# EAGLE design LilyPad-E-Sewing-Kit_v14 (EAGLE 7.7.0)
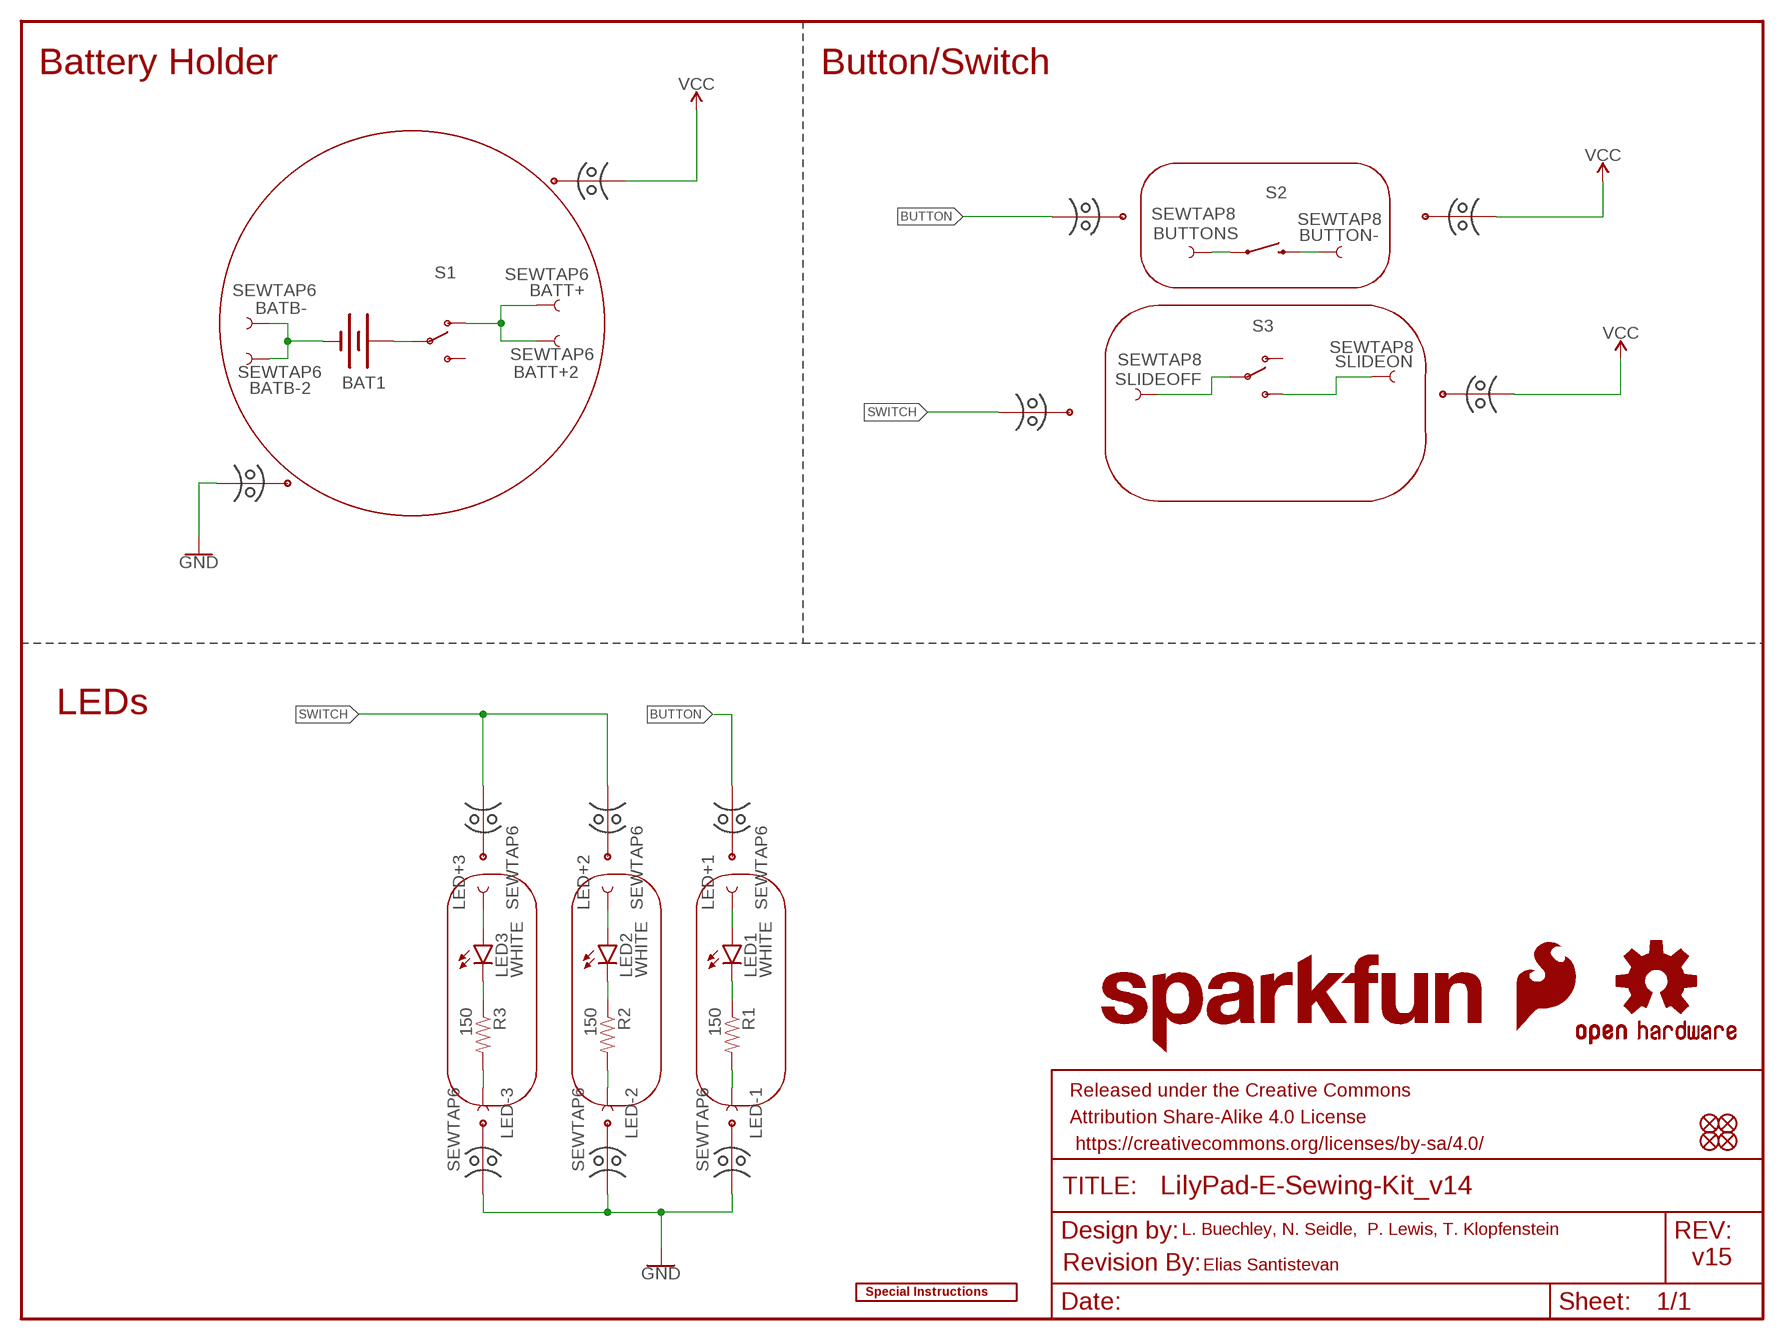
[diagram p0: schematic, sheet 1]

## Parts
BAT1  20mm coincell  BATTERY20MM_4LEGS  [BATTCON_20MM_4LEGS]
BATB-  SEWTAP6  [PETAL-SMALL-2SIDE]
BATB-2  SEWTAP6  [PETAL-SMALL-2SIDE]
BATT+  SEWTAP6  [PETAL-SMALL-2SIDE]
BATT+2  SEWTAP6  [PETAL-SMALL-2SIDE]
BUTTON-  SEWTAP8  [PETAL-MEDIUM-2SIDE]
BUTTONS  SEWTAP8  [PETAL-MEDIUM-2SIDE]
FD1  FIDUCIALUFIDUCIAL  [MICRO-FIDUCIAL]
FD2  FIDUCIALUFIDUCIAL  [MICRO-FIDUCIAL]
FD3  FIDUCIALUFIDUCIAL  [MICRO-FIDUCIAL]
FD4  FIDUCIALUFIDUCIAL  [MICRO-FIDUCIAL]
FRAME1  FRAME-LETTER  [CREATIVE_COMMONS]
LED1  WHITE  LED-WHITE1206  [LED-1206]
LED2  WHITE  LED-WHITE1206  [LED-1206]
LED3  WHITE  LED-WHITE1206  [LED-1206]
LED+1  SEWTAP6  [PETAL-SMALL-2SIDE]
LED+2  SEWTAP6  [PETAL-SMALL-2SIDE]
LED+3  SEWTAP6  [PETAL-SMALL-2SIDE]
LED-1  SEWTAP6  [PETAL-SMALL-2SIDE]
LED-2  SEWTAP6  [PETAL-SMALL-2SIDE]
LED-3  SEWTAP6  [PETAL-SMALL-2SIDE]
LOGO1  SFE_LOGO_FLAME.1_INCH  [SFE_LOGO_FLAME_.1]
LOGO2  OSHW-LOGOS  [OSHW-LOGO-S]
LOGO3  SFE_LOGO_NAME.1_INCH  [SFE_LOGO_NAME_.1]
MB1  MOUSE-BITE-12_HOLES  [MOUST-BITE-1-(2_HOLES)]
MB2  MOUSE-BITE-12_HOLES  [MOUST-BITE-1-(2_HOLES)]
MB3  MOUSE-BITE-12_HOLES  [MOUST-BITE-1-(2_HOLES)]
MB4  MOUSE-BITE-12_HOLES  [MOUST-BITE-1-(2_HOLES)]
MB5  MOUSE-BITE-12_HOLES  [MOUST-BITE-1-(2_HOLES)]
MB6  MOUSE-BITE-12_HOLES  [MOUST-BITE-1-(2_HOLES)]
MB7  MOUSE-BITE-12_HOLES  [MOUST-BITE-1-(2_HOLES)]
MB8  MOUSE-BITE-12_HOLES  [MOUST-BITE-1-(2_HOLES)]
MB9  MOUSE-BITE-12_HOLES  [MOUST-BITE-1-(2_HOLES)]
MB10  MOUSE-BITE-12_HOLES  [MOUST-BITE-1-(2_HOLES)]
MB+  MOUSE-BITE-12_HOLES  [MOUST-BITE-1-(2_HOLES)]
MB-  MOUSE-BITE-12_HOLES  [MOUST-BITE-1-(2_HOLES)]
R1  150  150OHM-1/10W-1%(0603)  [0603-RES]
R2  150  150OHM-1/10W-1%(0603)  [0603-RES]
R3  150  150OHM-1/10W-1%(0603)  [0603-RES]
S1  S1  SWITCH-SPDTSMD  [AYZ0202]
S2  SWITCH-MOMENTARY-2SMD  [TACTILE-SWITCH-SMD]
S3  S3  SWITCH-SPDTSMD  [AYZ0202]
SLIDEOFF  SEWTAP8  [PETAL-MEDIUM-2SIDE]
SLIDEON  SEWTAP8  [PETAL-MEDIUM-2SIDE]
U$1  REVISION  [REVISION]
U$9  SPECIAL_INSTRUCTIONS-ORDERING  [ORDERING_INSTRUCTIONS]

## Nets
BUTTON: BUTTONS.1 LED1.A LED+1.1 MB3.P$1 MB9.P$1 S2.1
GND: BAT1.NEGATIVE(-) BATB-2.1 BATB-.1 LED-1.1 LED-2.1 LED-3.1 MB6.P$1 MB7.P$1 MB8.P$1 MB-.P$1 R1.2 R2.2 R3.2
N$1: BAT1.POSITIVE@1(+) BAT1.POSITIVE@2(+) BAT1.POSITIVE@3(+) BAT1.POSITIVE@4(+) S1.2(P)
N$11: LED1.C R1.1
N$12: LED2.C R2.1
N$13: LED3.C R3.1
SWITCH: LED2.A LED3.A LED+2.1 LED+3.1 MB4.P$1 MB5.P$1 MB10.P$1 S3.2(P) SLIDEOFF.1
VCC: BATT+2.1 BATT+.1 BUTTON-.1 MB1.P$1 MB2.P$1 MB+.P$1 S1.1(O) S2.3 S3.3(S) SLIDEON.1
Unconnected: S1.3(S) S3.1(O)

## Notes on the sheet
- Battery Holder | Button/Switch
- LEDs
- L. Buechley, N. Seidle,  P. Lewis, T. Klopfenstein
- v15
- Elias Santistevan

## Library data of the parts
BAT1 = SparkFun-Electromechanical:BATTERY: Battery Holders Various common sizes : AA, AAA, 18650 (PRT-12895), 20mm coin cell and 12mm coin cell. 20MM_4LEGS, BATT-10373; PROD_ID: BATT-10373
BATB- BATB-2 BATT+ BATT+2 BUTTON- BUTTONS LED+1-LED+3 LED-1-LED-3 SLIDEOFF SLIDEON = LilyPad-Wearables:SEWTAP: Sew Taps for LilyPad Boards.
FD1-FD4 = SparkFun-Aesthetics:FIDUCIAL: Fiducial Alignment Points Various fiducial points for machine vision alignment.
FRAME1 = SparkFun-Aesthetics:FRAME-LETTER: Schematic Frame Standard 8.5x11 US Letter frame
LED1-LED3 = SparkFun-LED:LED-WHITE: White SMD LEDs LilyPad 1206- DIO-09955; PROD_ID: DIO-09955
LOGO1 = SparkFun-Aesthetics:SFE_LOGO_FLAME: SFE Logo, flame only This is the SparkFun flame logo. The logo on the schematic will always be the same size; the package variant is the height of the flame. Default layer for the logo on the board is tSilk.
LOGO2 = SparkFun-Aesthetics:OSHW-LOGO: Open Source Hardware Logo This logo indicates the piece of hardware it is found on incorporates a OSHW license and/or adheres to the definition of open source hardware found here: http://freedomdefined.org/OSHW
LOGO3 = SparkFun-Aesthetics:SFE_LOGO_NAME: SparkFun Font Logo This is the SparkFun name logo. The logo on the schematic will always be the same size; the package variant is the height of the flame part of the logo (or the height the flame would be, if it were drawn). Default layer for the logo on the board is tSilk.
MB1-MB10 MB+ MB- = Testing:MOUSE-BITE-1
R1-R3 = SparkFun-Resistors:150OHM-1/10W-1%(0603): RES-11028; PROD-ID: 13326
S1 S3 = SparkFun-Electromechanical:SWITCH-SPDT: SPDT Switch Simple slide switch, Spark Fun Electronics SKU : COM-00102 DPDT SMT slide switch, AYZ0202, SWCH-08179; PROD_ID: SWCH-08179; SF_ID: COM-00597
S2 = SparkFun-Electromechanical:SWITCH-MOMENTARY-2: Various NO switches- pushbuttons, reed, etc; PROD_ID: SWCH-08247
U$1 = SparkFun-Aesthetics:REVISION
U$9 = SparkFun-Aesthetics:SPECIAL_INSTRUCTIONS: Special Ordering/Production Instructions Alert Symbol for special PCB ordering instructions or unique production process warnings. Ordering Instructions Production Instructions Types of information that should be added to box: Copper weight Soldermask color Silk color PCB thickness Number of layers PCB Standard: 1.6mm FR4 1 oz copper immersion silver plating red soldermask white silkscreen Types of information that should be added to box: Special wash requirements Depaneling instructions Humidification Glue curing Default text settings: 0.07 inch 9% ratio 50% line distance

## Net classes
1 VCC: width 0.203 mm

## Board
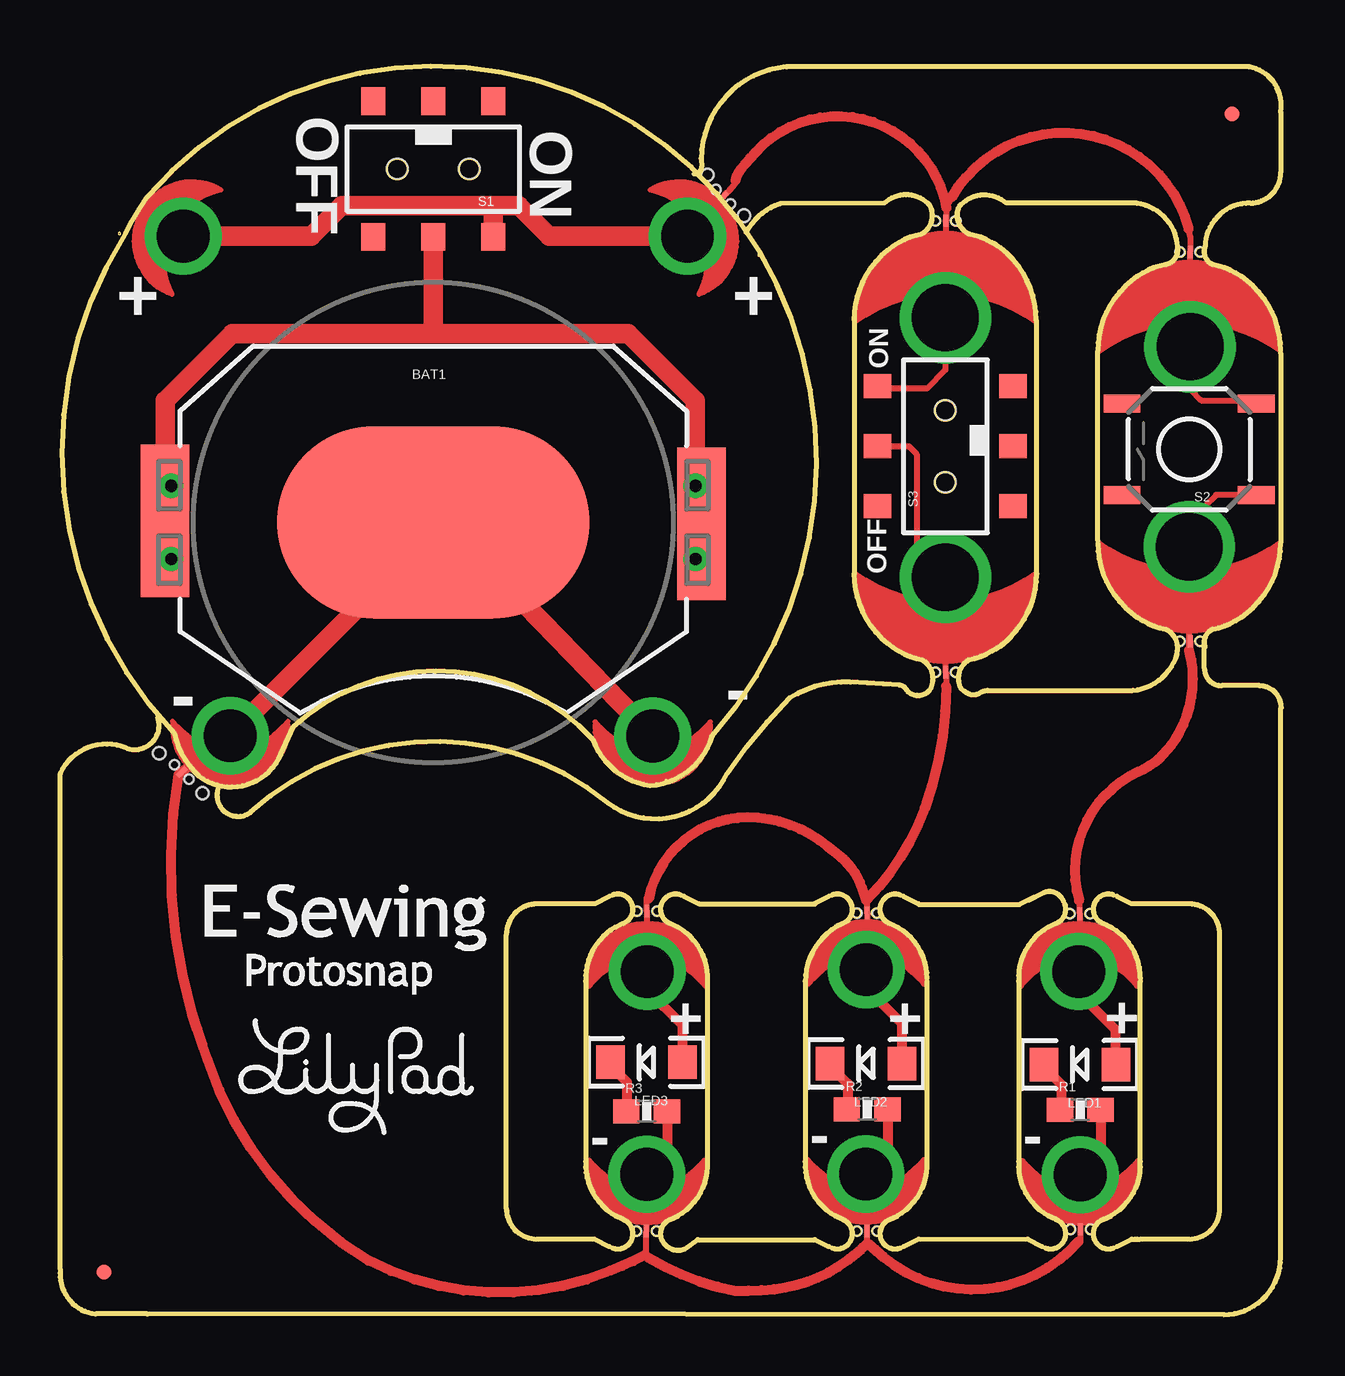
[diagram p1: board, top side]
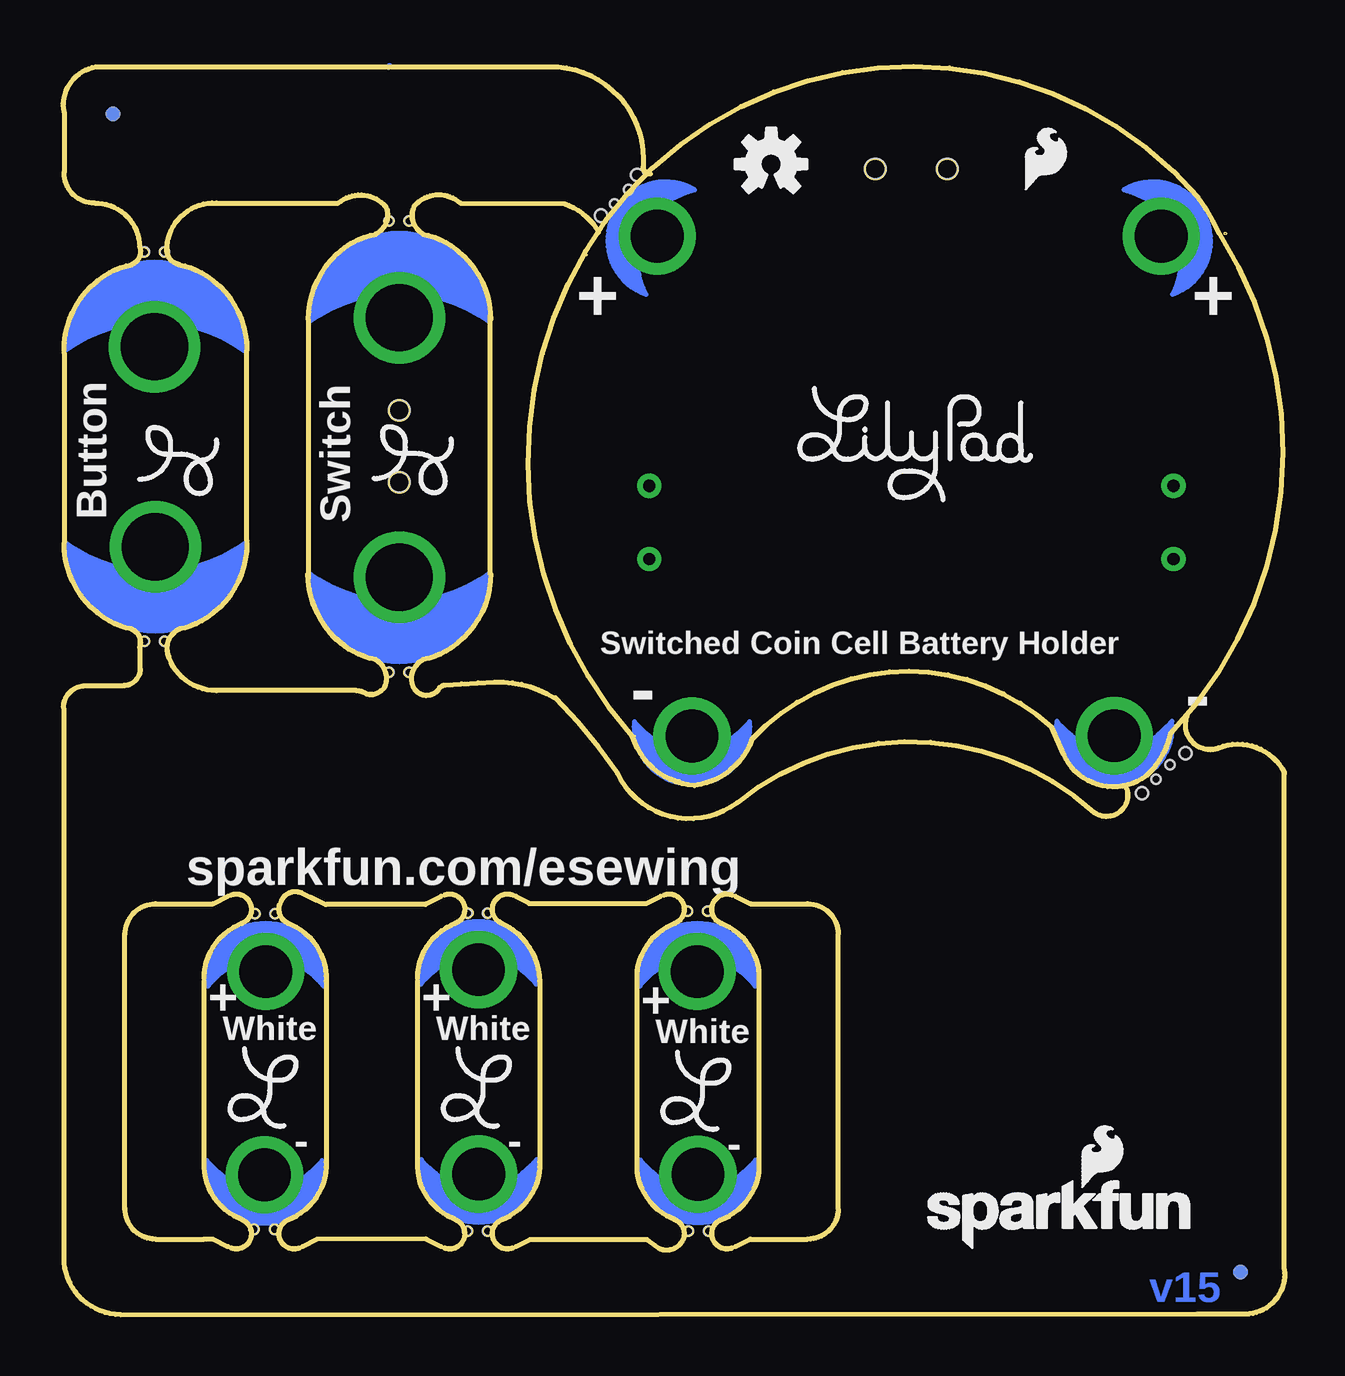
[diagram p2: board, bottom side, seen from below]

Size 50.94 x 52.08 mm. Coordinates in mm from the lower left corner, seen from the top.
Outline: 1080 segments
Outline: circle at 36.48,45.62 radius 0.19
Outline: circle at 37.32,45.62 radius 0.19
Outline: circle at 46.7,44.32 radius 0.19
Outline: circle at 47.53,44.32 radius 0.19
Outline: circle at 42.05,16.76 radius 0.19
Outline: circle at 42.89,16.76 radius 0.19
Outline: circle at 33.16,16.79 radius 0.19
Outline: circle at 34,16.79 radius 0.19
Outline: circle at 24.04,16.87 radius 0.19
Outline: circle at 24.88,16.87 radius 0.19
Outline: circle at 24.83,3.53 radius 0.19
Outline: circle at 23.99,3.53 radius 0.19
Outline: circle at 34.02,3.53 radius 0.19
Outline: circle at 33.18,3.53 radius 0.19
Outline: circle at 42.91,3.61 radius 0.19
Outline: circle at 42.07,3.61 radius 0.19
Outline: circle at 47.48,28.12 radius 0.19
Outline: circle at 46.64,28.12 radius 0.19
Outline: circle at 37.35,26.82 radius 0.19
Outline: circle at 36.51,26.82 radius 0.19
Copper layers (1*16): Top 0.035mm / dielectric 1.5mm / Bottom 0.035mm
Design rules "SparkFun-2-layer-STANDARD *": minimum track width 10mil, minimum drill 20mil, track to track 10mil, track to pad 8mil, pad to pad 8mil, via to via 10mil, smd to smd 8mil, copper to edge 8mil, drill to drill 8mil, minimum pad ring 10mil, minimum via ring 10mil, stop-mask expansion 4mil, vias tented up to drill 25mil, thermal gap 10mil
Holes 0.51 mm at 4.14,23.46 5.94,21.78 26.98,47.55 28.49,45.86

### Footprints (pad centres in the part's own frame; a part is rotated, then mirrored left to right if it is on the bottom)
BATTCON_20MM_4LEGS = smd 13 x 8: NEGATIVE 0,0 | smd 2.032 x 3.175: POSITIVE@1 -11.176,1.651; POSITIVE@2 -11.176,-1.524; POSITIVE@3 11.176,1.524; POSITIVE@4 11.176,-1.651
PETAL-SMALL-2SIDE = drill 2.2: 1 0,0
PETAL-MEDIUM-2SIDE = drill 2.794: 1 0,-0.254
MICRO-FIDUCIAL = smd 0.635 x 0.635: 1 0,0
LED-1206 = smd 1.2 x 1.4: A -1.5,0; C 1.5,0
MOUST-BITE-1-(2_HOLES) = smd 0.203 x 0.508 bottom: P$1 -0.013,0 | hole 0.381: -0.432,0; 0.406,0
0603-RES = smd 1.1 x 1: 1 -0.85,0; 2 0.85,0
AYZ0202 = smd 1 x 1.15: 1 -2.5,2.825; 2 0,2.825; 3 2.5,2.825; 4 -2.5,-2.825; 5 0,-2.825; 6 2.5,-2.825 | hole 0.85: 1.5,0; -1.5,0
TACTILE-SWITCH-SMD = smd 1.524 x 0.762: 1 -2.794,1.905; 2 2.794,1.905; 3 -2.794,-1.905; 4 2.794,-1.905

### Placement (x,y rotation side)
BAT1  15.56,33.07 0 top
BATB-  7.1,24.18 0 top
BATB-2  24.7,24.17 0 top
BATT+  5.14,45.01 245 top
BATT+2  26.15,45.01 115 top
BUTTON-  47.09,40.14 180 top
BUTTONS  47.05,32.31 0 top
FD1  48.83,50.09 0 top
FD2  1.84,1.83 0 top
FD3  48.83,50.09 0 bottom
FD4  1.84,1.83 0 bottom
FRAME1  0.51,-18.5 0 top  (outside the outline)
LED1  42.5,10.48 180 top
LED2  33.59,10.52 180 top
LED3  24.44,10.57 180 top
LED+1  42.45,14.35 180 top
LED+2  33.59,14.43 180 top
LED+3  24.47,14.35 180 top
LED-1  42.51,5.88 0 top
LED-2  33.58,5.91 0 top
LED-3  24.45,5.89 0 top
LOGO1  11.11,46.58 0 bottom
LOGO2  21.4,48.01 0 bottom
LOGO3  SFE_LOGO_NAME_FLAME.1_INCH  [SFE_LOGO_NAME_FLAME_.1]  15.3,2.72 0 bottom
MB1  36.89,45.64 0 bottom
MB2  47.08,44.35 0 bottom
MB3  42.48,16.76 0 bottom
MB4  33.61,16.79 0 bottom
MB5  24.45,16.87 0 bottom
MB6  24.42,3.53 0 bottom
MB7  33.61,3.53 0 bottom
MB8  42.5,3.61 0 bottom
MB9  47.08,28.12 0 bottom
MB10  36.92,26.82 180 bottom
MB+  27.65,46.63 225 bottom
MB-  5.07,22.68 45 bottom
R1  42.51,8.59 0 top
R2  33.63,8.6 0 top
R3  24.45,8.52 0 top
S1  15.56,47.8 180 top
S2  47.05,36.12 180 top
S3  36.89,36.25 90 top
SLIDEOFF  36.89,31.04 0 top
SLIDEON  36.89,41.35 180 top
U$1  12.05,-22.96 0 top  (outside the outline)
U$2  [LOGO-LILYPAD]  12.38,10.31 0 top
U$3  [LOGO-LILYPAD]  15.35,36.68 0 bottom
U$4  [LOGO-L]  42.57,9.5 0 bottom
U$5  [LOGO-L]  36.31,35.68 90 bottom
U$6  [LOGO-L]  46.09,35.65 90 bottom
U$7  [LOGO-L]  33.68,9.5 0 bottom
U$8  [LOGO-L]  24.54,9.38 0 bottom
U$9  -10.1,-26.49 0 top  (outside the outline)

### Tracks (layer width: path | path; a pad name or v marks a point on that pad's centre or on a via)
BUTTON
  Top 0.254: S2.1 48.17,34.21 47.18,33.25 47.05,33.12 BUTTONS.1 47.05,27.74 | 47.05,27.74 | MB9.P$1 47.09,27.78 47.05,27.74 | 42.46,17.31 42.49,17.28 MB3.P$1 42.49,14.39 LED+1.1
  Top 0.406: 42.46,17.31 arc-82 44.94,22.68 arc22 45.96,23.39 arc14 46.63,24.29 arc44 47.05,27.74 | LED1.A 44,11.92 42.47,13.45 42.47,14.34 LED+1.1
GND
  Top 0.254: 42.43,3.1 42.52,3.19 MB8.P$1 LED-1.1 | 24.5,2.44 24.45,2.44 24.37,2.51 24.43,2.58 MB6.P$1 24.45,3.54 LED-3.1 | MB7.P$1 33.63,3.06 33.64,3.02 33.61,4.8 33.59,4.83 LED-2.1
  Top 0.406: 33.64,3.02 33.65,3.02 | 33.65,3.02 34.33,2.44 arc88 42.43,3.1 | 24.5,2.44 arc20 28.15,1.04 arc6 29.75,1.12 arc31 32.8,2.31 arc6 33.65,3.02 | R3.2 25.3,6.74 LED-3.1 | R2.2 34.48,6.94 LED-2.1 | R1.2 43.36,6.93 LED-1.1 | 24.37,2.51 arc-4 22.95,1.88 arc-50 12.84,2.31 arc-40 6.15,10.67 arc-1 5.51,12.58 arc-26 4.94,22.56 MB-.P$1 BATB-.1
  Top 0.813: BATB-.1 15.56,32.64 BAT1.NEGATIVE 16.06,33.07 BATB-2.1
N$1  (via drill 0.51)
  Top 0.254: BAT1.POSITIVE@3 v26.48,34.59
  Top 0.813: 15.56,40.94 7.17,40.94 4.38,38.15 BAT1.POSITIVE@1 | 15.56,40.94 23.68,40.94 26.48,38.15 v26.48,34.59 BAT1.POSITIVE@4 v26.48,31.55 | BAT1.POSITIVE@1 v4.63,34.59 v4.63,31.55 BAT1.POSITIVE@2 | S1.2 15.56,40.94 | BAT1.POSITIVE@1 4.38,34.34 4.13,34.09 4.13,34.47 BAT1.POSITIVE@1
N$3
  Bottom 0.254: 37.3,52.09 37.34,52.06
N$11
  Top 0.406: LED1.C 41,10.37 41.72,9.64 41.72,8.64 R1.1
N$12
  Top 0.406: LED2.C 32.09,10.41 32.82,9.67 32.82,8.65 R2.1
N$13
  Top 0.406: LED3.C 22.94,10.43 23.61,9.75 23.61,8.54 R3.1
SWITCH
  Top 0.254: 36.92,26.24 36.92,26.81 MB10.P$1 36.89,26.83 SLIDEOFF.1 35.7,31.98 35.7,35.92 35.37,36.25 S3.2 | LED+3.1 24.48,14.36 MB5.P$1 24.46,17.32 24.52,17.38 | 33.59,17.32 33.63,17.28 MB4.P$1 33.63,14.46 LED+2.1 33.61,14.41
  Top 0.406: 36.92,26.24 arc-20 36.03,21.16 arc-25 33.59,17.32 33.41,17.86 arc33 32.52,19.13 arc-1 31.99,19.56 arc40 28.64,20.78 arc78 24.52,17.38 | LED2.A 35.09,12.16 33.61,13.64 33.61,14.41 | LED3.A 25.94,12.1 24.48,13.56 LED+3.1
VCC
  Top 0.254: BATT+2.1 MB+.P$1 arc-1 28.03,47.07 arc33 28.15,47.32 | 37.17,46.63 36.93,46.18 36.93,45.67 MB1.P$1 36.9,42.09 | S2.3 49.72,38.15 47.56,38.15 47.09,38.62 BUTTON-.1 MB2.P$1 | 47.03,45.31 47.09,45 47.09,44.99 MB2.P$1 | 36.9,42.09 36.9,41.61 | S3.3 34.15,38.66 36.13,38.66 36.89,39.42 SLIDEON.1 36.89,42.07 36.9,42.09 | MB2.P$1
  Top 0.406: 28.15,47.32 arc-28 28.36,47.78 arc-4 28.97,48.49 arc-128 36.93,46.18 | 37.17,46.63 arc-135 47.03,45.31
  Top 0.813: BATT+.1 10.48,45.01 11.75,46.28 18.1,46.28 | 18.1,46.28 19.11,46.28 20.38,45.01 BATT+2.1 | S1.1 18.06,46.24 18.1,46.28

### Text on the board
Bottom: v15
tPlace: OFF | ON | + | + | ON | OFF | - | - | + | + | + | - | - | -
bPlace: + | + | Switch | Button | - | - | Switched Coin Cell Battery Holder | sparkfun.com/esewing | + | + | + | White | White | White | - | - | -
Measures: All Units Inches
tDocu: L. Buechley, N. Seidle, P. Lewis, T. Klopfenstein | Elias Santistevan | Board Thickness: 0.032" | Purple Solder Mask